# EAGLE design 4_digit_display (EAGLE 6.6.0)
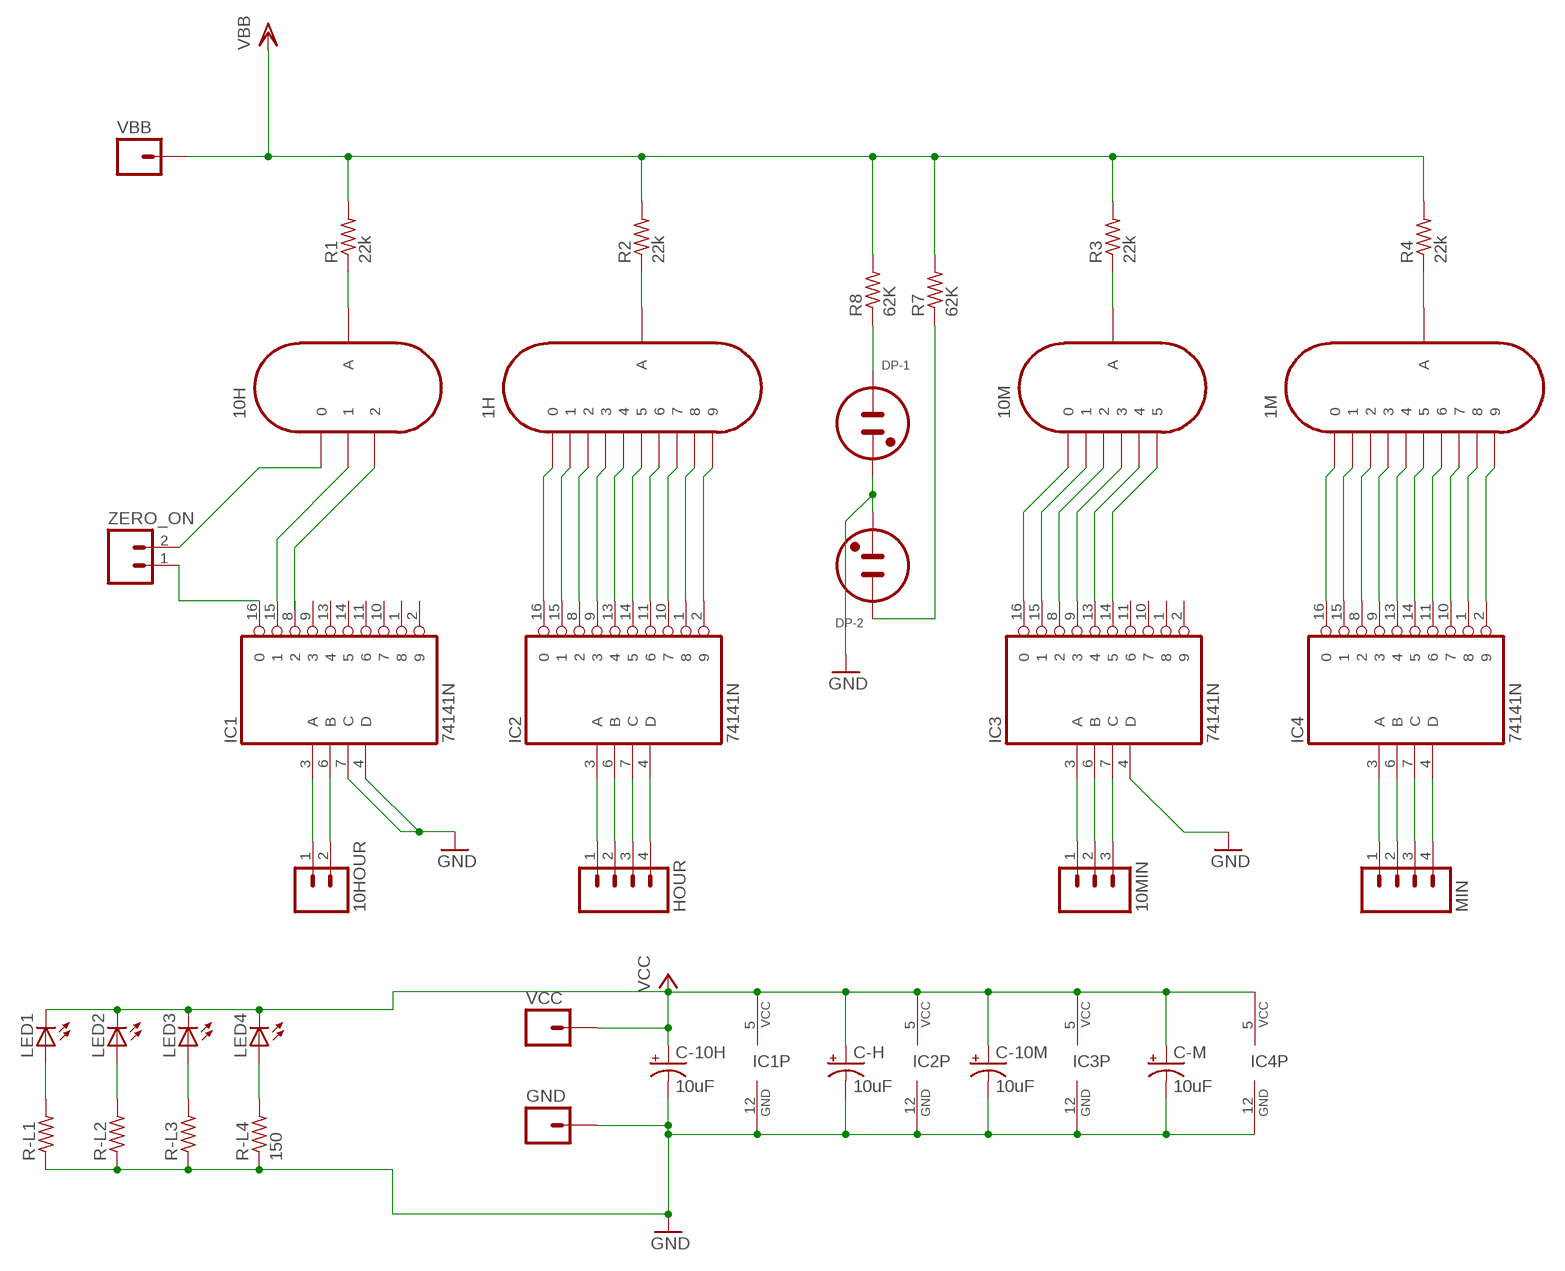
[diagram p0: schematic, sheet 1]

## Parts
1H  IN-12A-NO_DP  [IN-12_NO-DP]
1M  IN-12A-NO_DP  [IN-12_NO-DP]
10H  IN-12_2DIGIT  [IN-12_2DIGIT]
10HOUR  M02PTH  [1X02]
10M  IN-12_6DIGIT  [IN-12_6DIGIT]
10MIN  M03PTH  [1X03]
C-10H  10uF  CAPACITOR_POLB/3528-21R  [B/3528-21R]
C-10M  10uF  CAPACITOR_POLB/3528-21R  [B/3528-21R]
C-H  10uF  CAPACITOR_POLB/3528-21R  [B/3528-21R]
C-M  10uF  CAPACITOR_POLB/3528-21R  [B/3528-21R]
DP-1  INS-1  [INS-1]
DP-2  INS-1  [INS-1]
GND  M01PTH  [1X01]
HOUR  M04PTH  [1X04]
IC1  74141N  [DIL16]
IC2  74141N  [DIL16]
IC3  74141N  [DIL16]
IC4  74141N  [DIL16]
LED1  LED1210  [LED1210]
LED2  LED1210  [LED1210]
LED3  LED1210  [LED1210]
LED4  LED1210  [LED1210]
MIN  M04PTH  [1X04]
R1  22k  RESISTOR0207/10  [0207/10]
R2  22k  RESISTOR0207/10  [0207/10]
R3  22k  RESISTOR0207/10  [0207/10]
R4  22k  RESISTOR0207/10  [0207/10]
R7  62K  RESISTOR0207/10  [0207/10]
R8  62K  RESISTOR0207/10  [0207/10]
R-L1  RESISTORR1206  [R1206]
R-L2  RESISTORR1206  [R1206]
R-L3  RESISTORR1206  [R1206]
R-L4  150  RESISTORR1206  [R1206]
VBB  M01PTH  [1X01]
VCC  M01PTH  [1X01]
ZERO_ON  M02PTH  [1X02]

## Nets
GND: C-10H.- C-10M.- C-H.- C-M.- DP-1.K DP-2.K GND.1 IC1.4(D) IC1.7(C) IC1.12(GND) IC2.12(GND) IC3.4(D) IC3.12(GND) IC4.12(GND) R-L1.1 R-L2.1 R-L3.1 R-L4.1
N$1: 1M.0 IC4.16
N$2: 1M.1 IC4.15
N$3: 1M.2 IC4.8
N$4: 1M.3 IC4.9
N$5: 1M.4 IC4.13
N$6: 1M.5 IC4.14
N$7: 1M.6 IC4.11
N$8: 1M.7 IC4.10
N$9: 1M.8 IC4.1
N$10: 1M.9 IC4.2
N$11: 10M.0 IC3.16
N$12: 10M.1 IC3.15
N$13: 10M.2 IC3.8
N$14: 10M.3 IC3.9
N$15: 10M.4 IC3.13
N$16: 10M.5 IC3.14
N$17: 1H.0 IC2.16
N$18: 1H.1 IC2.15
N$19: 1H.2 IC2.8
N$20: 1H.3 IC2.9
N$21: 1H.4 IC2.13
N$22: 1H.5 IC2.14
N$23: 1H.6 IC2.11
N$24: 1H.7 IC2.10
N$25: 1H.8 IC2.1
N$26: 1H.9 IC2.2
N$27: 10H.1 IC1.15
N$28: 10H.2
N$29: DP-1.A R8.1
N$30: DP-2.A R7.1
N$31: IC4.3(A) MIN.1
N$32: 1M.A R4.1
N$33: 10M.A R3.1
N$34: 1H.A R2.1
N$35: 10H.A R1.1
N$36: IC4.6(B) MIN.2
N$37: IC4.7(C) MIN.3
N$38: IC4.4(D) MIN.4
N$39: 10MIN.1 IC3.3(A)
N$40: 10MIN.2 IC3.6(B)
N$41: 10MIN.3 IC3.7(C)
N$42: HOUR.1 IC2.3(A)
N$43: HOUR.2 IC2.6(B)
N$44: HOUR.3 IC2.7(C)
N$45: HOUR.4 IC2.4(D)
N$46: 10HOUR.1 IC1.3(A)
N$47: 10HOUR.2 IC1.6(B)
N$48: IC1.16 ZERO_ON.1
N$49: 10H.0 ZERO_ON.2
N$76: LED1.A R-L1.2
N$77: LED2.A R-L2.2
N$78: LED3.A R-L3.2
N$79: LED4.A R-L4.2
VBB: R1.2 R2.2 R3.2 R4.2 R7.2 R8.2 VBB.1
VCC: C-10H.+ C-10M.+ C-H.+ C-M.+ IC1.5(VCC) IC2.5(VCC) IC3.5(VCC) IC4.5(VCC) LED1.C LED2.C LED3.C LED4.C VCC.1
Unconnected: IC1.1 IC1.2 IC1.8 IC1.9 IC1.10 IC1.11 IC1.13 IC1.14 IC3.1 IC3.2 IC3.10 IC3.11

## Library data of the parts
1H 1M = iStivi - Tubes:IN-12A: IN-12A: medium numeric topview nixie tube
10H = iStivi - Tubes:IN-12_2DIGIT: IN-12 DIGITS 0-2 IN-12 nixie tube using only pins 0-2 for clock display.
10HOUR ZERO_ON = iStivi - Header-Connector:M02: Header 2 Standard 2-pin 0.1" header. Use with straight break away headers (SKU : PRT-00116), right angle break away headers (PRT-00553), swiss pins (PRT-00743), machine pins (PRT-00117), and female headers (PRT-00115). Molex polarized connector foot print use with SKU : PRT-08233 with associated crimp pins and housings.
10M = iStivi - Tubes:IN-12_6DIGIT: IN-12 DIGITS 0-6 IN-12 pin layout with only the pins 0-5 connected. For clock display.
10MIN = iStivi - Header-Connector:M03: Header 3 Standard 3-pin 0.1" header. Use with straight break away headers (SKU : PRT-00116), right angle break away headers (PRT-00553), swiss pins (PRT-00743), machine pins (PRT-00117), and female headers (PRT-00115). Molex polarized connector foot print use with SKU : PRT-08232 with associated crimp pins and housings.
C-10H C-10M C-H C-M = iStivi - RCLD:CAPACITOR_POL: POLARIZED CAPACITOR, American symbol
DP-1 DP-2 = iStivi - Tubes:INS-1: INS-1 Neon indicator (wire connection)
GND VBB VCC = iStivi - Header-Connector:M01: Header 1 Standard 1-pin 0.1" header. Use with straight break away headers (SKU : PRT-00116), right angle break away headers (PRT-00553), swiss pins (PRT-00743), machine pins (PRT-00117), and female headers (PRT-00115).
HOUR MIN = iStivi - Header-Connector:M04: Header 4 Standard 4-pin 0.1" header. Use with straight break away headers (SKU : PRT-00116), right angle break away headers (PRT-00553), swiss pins (PRT-00743), machine pins (PRT-00117), and female headers (PRT-00115). Molex polarized connector foot print use with SKU : PRT-08231 with associated crimp pins and housings. 1MM SMD Version SKU: PRT-10208
IC1-IC4 = iStivi - ICs:74*141: Nixie Driver BCD to decimal decoder/driver
LED1-LED4 = iStivi - LED:LED: LEDs Standard schematic elements and footprints for 5mm, 3mm, 1206, and 0603 sized LEDs. 5mm - Spark Fun Electronics SKU : COM-00529 (and others)
R1-R4 R7 R8 R-L1-R-L4 = iStivi - RCLD:RESISTOR: RESISTOR

## Board
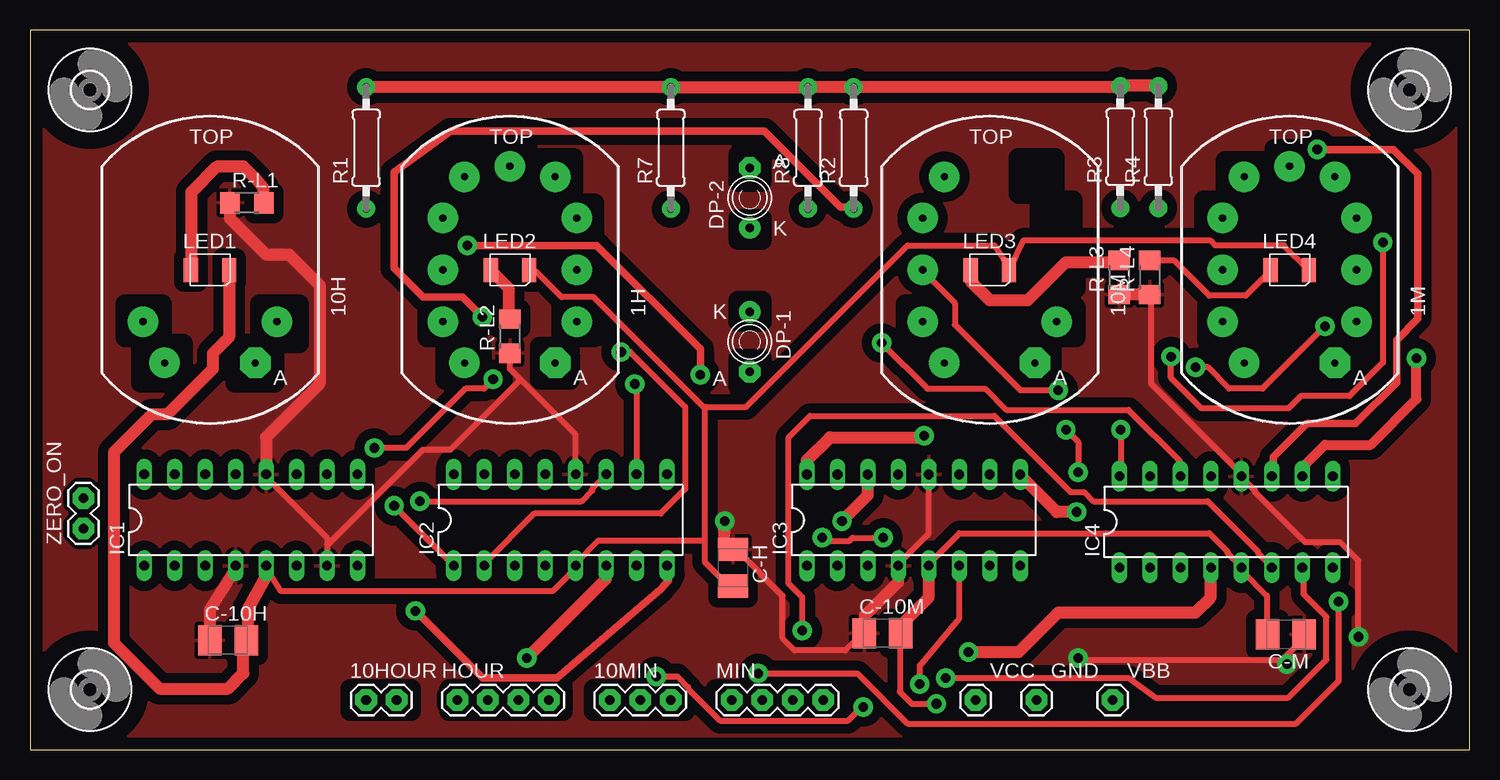
[diagram p1: board, top side]
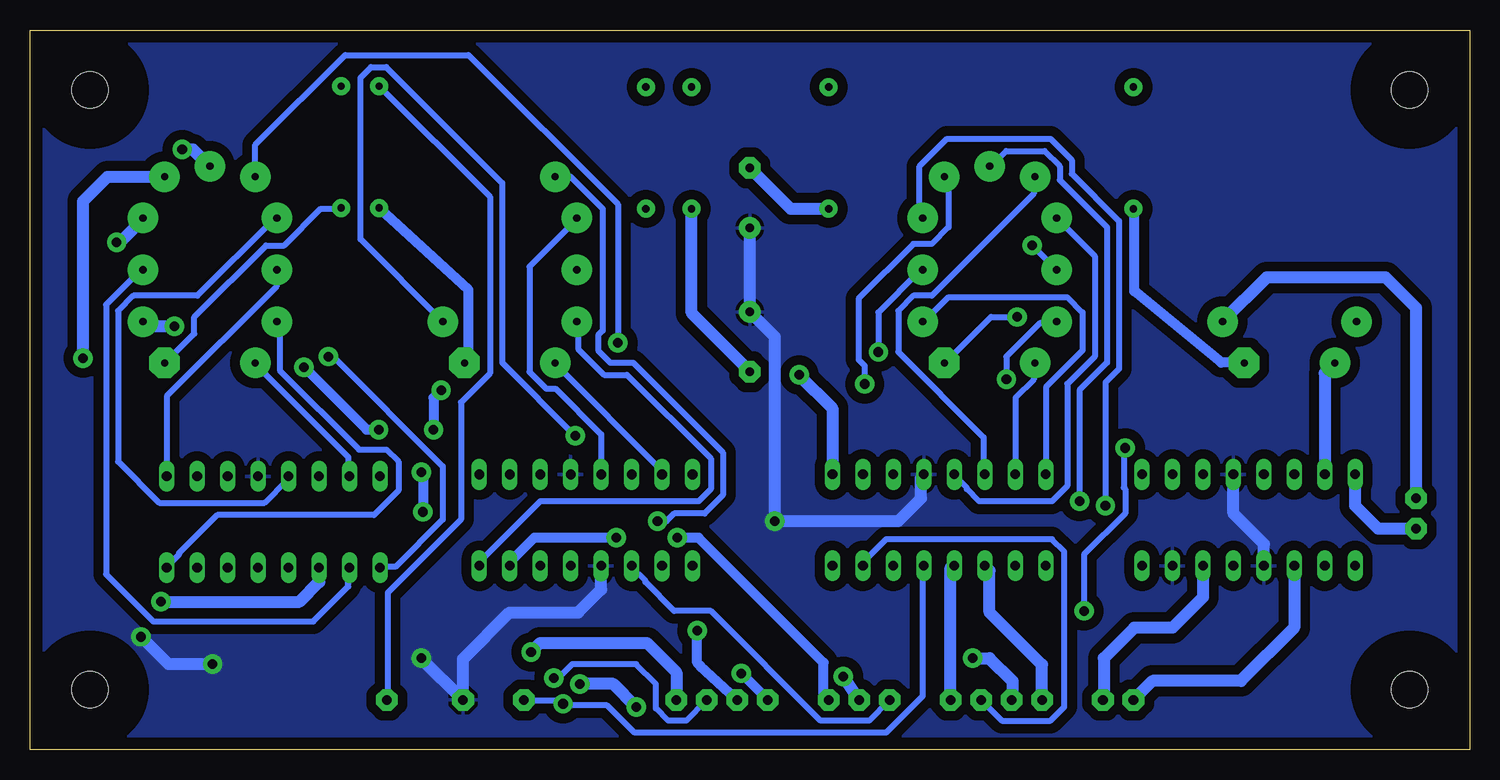
[diagram p2: board, bottom side, seen from below]

Size 120 x 60 mm. Coordinates in mm from the lower left corner, seen from the top.
Outline: 0,0 120,0 120,60 0,60 0,0
Copper layers (1*16): Top 0.035mm / dielectric 1.5mm / Bottom 0.035mm
Design rules "iStivi-0.8mm via-20mil-track": minimum track width 20mil, minimum drill 0.8mm, track to track 20mil, track to pad 20mil, pad to pad 10mil, via to via 20mil, smd to smd 10mil, copper to edge 40mil, drill to drill 8mil, minimum pad ring 10mil, minimum via ring 16mil, stop-mask expansion 0mil, vias tented up to drill 0mil, thermal gap 12mil
tRestrict: area 8,34.4 to 11,37.2; area 9.2,30.6 to 12.8,33.9; area 17.1,30.6 to 20.4,33.9; area 19.1,33.9 to 22.4,37.2; area 33.1,43 to 35.9,45.5; area 32.8,38.7 to 35.9,41.2; area 33.1,34.4 to 35.6,36.9; area 34.6,30.8 to 37.7,33.6; area 42.5,30.8 to 45,33.6; area 44.3,34.4 to 47.1,37.2; area 44,38.4 to 47.3,41.5; area 44,43 to 47.1,45.5; 32 more areas

### Footprints (pad centres in the part's own frame; a part is rotated, then mirrored left to right if it is on the bottom)
IN-12_NO-DP = drill 0.6 pad 2.54: 0 5.59,-4.32; 1 -3.78,-7.766; 2 -5.59,-4.32; 3 -5.59,0; 4 -5.59,4.32; 5 -3.78,7.766; 6 0,8.64; 7 3.78,7.766; 8 5.59,4.32; 9 5.59,0 | drill 0.6 pad 2.54 octagon: A 3.78,-7.766
IN-12_2DIGIT = drill 0.6 pad 2.54: 0 5.59,-4.32; 1 -3.78,-7.766; 2 -5.59,-4.32 | drill 0.6 pad 2.54 octagon: A 3.78,-7.766
1X02 = drill 0.8 pad 1.8 octagon: 1 0,0; 2 2.54,0
IN-12_6DIGIT = drill 0.6 pad 2.54: 0 5.59,-4.32; 1 -3.78,-7.766; 2 -5.59,-4.32; 3 -5.59,0; 4 -5.59,4.32; 5 -3.78,7.766 | drill 0.6 pad 2.54 octagon: A 3.78,-7.766
1X03 = drill 0.8 pad 1.8 octagon: 1 0,0; 2 2.54,0; 3 5.08,0
B/3528-21R = smd 1.95 x 2.5: + 1.525,0; - -1.525,0
INS-1 = drill 0.7 pad 1.8 octagon: A 0,2.5 | drill 0.7 pad 1.8: K 0,-2.5
1X01 = drill 0.8 pad 1.8 octagon: 1 0,0
1X04 = drill 0.8 pad 1.8 octagon: 1 0,0; 2 2.54,0; 3 5.08,0; 4 7.62,0
DIL16 = drill 0.8 long: 1 -8.89,-3.81; 2 -6.35,-3.81; 3 -3.81,-3.81; 4 -1.27,-3.81; 5 1.27,-3.81; 6 3.81,-3.81; 7 6.35,-3.81; 8 8.89,-3.81; 9 8.89,3.81; 10 6.35,3.81; 11 3.81,3.81; 12 1.27,3.81; 13 -1.27,3.81; 14 -3.81,3.81; 15 -6.35,3.81; 16 -8.89,3.81
LED1210 = smd 1.2 x 2: A -1.6,0; C 1.6,0
0207/10 = drill 0.6 pad 1.5: 1 -5.08,0; 2 5.08,0
R1206 = smd 1.6 x 1.803: 1 -1.422,0; 2 1.422,0
3,0 = hole 3: 0,0

### Placement (x,y rotation side)
1H  40,40 0 top
1M  105,40 0 top
10H  15,40 0 top
10HOUR  28.02,4.13 0 top
10M  80,40 0 top
10MIN  48.34,4.13 0 top
C-10H  16.51,9.12 0 top
C-10M  71.07,9.7 0 top
C-H  58.6,15.16 270 top
C-M  104.69,9.6 180 top
DP-1  60,34 180 top
DP-2  60,46 0 top
GND  83.9,4.13 0 top
HOUR  35.64,4.13 0 top
IC1  18.41,19.14 0 top
IC2  44.22,19.14 0 top
IC3  73.66,19.13 0 top
IC4  99.71,18.97 0 top
LED1  15,40 0 top
LED2  40,40 0 top
LED3  80,40 0 top
LED4  105,40 0 top
MIN  58.5,4.13 0 top
R1  28.02,50.17 90 top
R2  68.66,50.17 90 top
R3  90.89,50.24 90 top
R4  94.06,50.24 90 top
R7  53.42,50.17 90 top
R8  64.85,50.17 90 top
R-L1  18.08,45.59 0 top
R-L2  40,34.46 90 top
R-L3  90.81,39.37 90 top
R-L4  93.34,39.37 90 top
U$2  [3,0]  5,55 0 top
U$3  [3,0]  5,5 0 top
U$4  [3,0]  115,5 0 top
U$5  [3,0]  115,55 0 top
VBB  90.25,4.13 0 top
VCC  78.82,4.13 0 top
ZERO_ON  4.45,18.41 90 top

### Tracks (layer width: path | path; a pad name or v marks a point on that pad's centre or on a via)
GND  (via drill 0.8)
  Top 0.508: 40.89,30.86 45.47,26.29 45.47,22.99 IC2.12 | 40.89,30.86 40.01,31.75 40.01,33.02 R-L2.1 | IC1.4 17.14,15.11 | 14.99,9.14 C-10H.- | 24.77,17.14 24.77,17.65 19.68,22.73 IC1.12 | 24.77,17.14 IC1.7 | 40.89,30.86 35.05,25.02 32.77,25.02 24.89,17.14 24.77,17.14 | 72.39,15.11 IC3.4 72.39,15.49 74.93,18.03 IC3.12 | 69.6,9.78 C-10M.- 69.34,9.65 67.94,8.26 63.75,8.26 62.74,9.27 62.74,12.83 58.93,16.64 58.67,16.64 C-H.- 58.55,16.89 57.91,17.53 | 90.81,37.97 R-L3.1 | 93.34,37.97 R-L4.1 93.47,37.72 93.47,30.48 101.09,22.86 IC4.12 101.09,22.61 102.11,21.59 102.11,21.46 106.3,17.27 109.22,17.27 110.74,15.75 v110.74,9.4 | 104.39,7.49 106.17,9.27 106.17,9.53 C-M.- | 104.39,7.49 87.5,7.49 v87.38,7.62 | 104.39,7.49 v104.78,7.11
  Top 1.016: 14.99,9.14 14.99,11.68 17.14,15.11 | 57.91,17.53 v57.91,19.05 | R-L1.1 16.66,44.3 19.68,41.27 21.59,41.27 24.13,38.73 24.13,30.48 19.68,26.04 IC1.12 | 90.81,37.97 93.22,37.97 93.34,38.1 R-L4.1 | 69.6,9.78 69.6,11.18 72.39,13.97 IC3.4
  Bottom 1.016: IC1.4 17.14,17.14 19.68,19.68 IC1.12 | IC2.12 45.72,22.71 45.72,20.95 47.62,19.05 v57.91,19.05 57.91,34.41 DP-1.K DP-2.K | v104.78,7.11 108.46,7.11 v110.74,9.4 | v87.38,7.62 87.38,7.61 GND.1 83.9,7.54 80.01,11.43 74.3,11.43 72.39,13.34 IC3.4
  pour Bottom (isolate 0.813): 0,0 120,0 120,60 0,60
  pour Top (isolate 0.813): 0,0 120,0 120,60 0,60
N$1  (via drill 0.8)
  Top 0.508: v90.93,26.67 90.93,22.86 IC4.16 | v97.16,31.88 98.17,31.88 99.95,30.1 102.74,30.1 v107.95,35.31
  Bottom 0.508: 110.49,35.56 110.24,35.31
  Bottom 0.813: v90.93,26.67 91.95,26.67 v97.16,31.88
  Bottom 1.016: 110.24,35.31 v107.95,35.31 | 110.49,35.56 1M.0
N$2
  Bottom 0.508: IC4.15 93.47,22.86 93.47,24.38 101.22,32.13 1M.1
N$3
  Bottom 0.508: IC4.8 108.58,15.24 107.57,16.26 107.57,16.38 104.39,19.56 91.31,19.56 89.28,21.59 89.28,24 90.3,25.02 92.58,25.02 99.19,31.62 99.19,35.43 99.31,35.56 1M.2
N$4
  Bottom 0.508: IC4.9 108.58,22.86 108.58,29.46 99.44,38.61 99.44,39.88 1M.3
N$5
  Bottom 0.508: IC4.13 98.55,22.73 98.55,22.48 100.46,20.57 109.22,20.57 112.65,24 112.65,36.58 111.38,37.85 106.05,37.85 99.69,44.2 99.44,44.2 1M.4
N$6  (via drill 0.8)
  Top 0.508: v70.99,33.91 74.8,30.1 79.63,30.1 81.41,28.32 91.57,28.32 95.89,24 95.89,22.86 IC4.14
  Bottom 0.508: v70.99,33.91 70.99,45.47 83.44,57.91 93.73,57.91 101.22,50.42 101.22,47.88 1M.5
N$7  (via drill 0.8)
  Top 0.508: 103.63,22.86 IC4.11
  Top 0.61: 103.63,22.86 103.63,24.38 106.43,27.18 110.49,27.18 113.92,30.61 113.92,34.16 115.7,35.94 115.7,48.01 113.67,50.04 v107.31,50.04
  Bottom 1.016: v107.31,50.04 106.43,50.04 105.03,48.64 1M.6
N$8  (via drill 0.8)
  Top 0.813: IC4.10 106.06,23.51 107.95,25.4 111.76,25.4 115.57,29.21 v115.57,32.64
  Bottom 1.016: v115.57,32.64 115.57,45.72 113.52,47.77 1M.7
N$9  (via drill 0.8)
  Top 0.508: v95.12,32.77 95.12,30.99 97.66,28.45 104.9,28.45 105.92,29.46 109.98,29.46 112.78,32.26 v112.78,42.29
  Bottom 0.508: v95.12,32.77 94.74,32.77 85.6,23.62 85.6,19.18 89.53,15.24 90.81,15.24 IC4.1
  Bottom 1.016: v112.78,42.29 112.52,42.29 110.62,44.2 1M.8
N$10
  Bottom 0.508: IC4.2 93.47,13.84 93.47,13.59 96.39,10.67 109.73,10.67 113.67,14.61 113.67,37.08 110.87,39.88 110.62,39.88 1M.9
N$11  (via drill 0.8)
  Top 1.016: IC3.16 64.77,24.13 66.67,26.04 74.42,26.04 v74.55,26.16
  Bottom 0.508: v74.55,26.16 80.64,32.26 80.64,47.24 90.3,56.9 91.57,56.9 92.46,56.01 92.46,42.55 10M.0
N$12
  Bottom 0.508: IC3.15 67.31,23.24 76.2,32.13 10M.1
N$13
  Bottom 0.508: IC3.8 82.55,15.62 77.47,20.7 64.26,20.7 63.25,21.72 63.25,24.26 70.23,31.24 72.14,31.24 74.3,33.4 74.3,35.56 10M.2
N$14  (via drill 0.8)
  Top 0.508: v87.38,23.11 87.38,25.65 v86.36,26.67 | v85.72,29.97 82.55,29.97 77.09,35.43 77.09,37.21 74.42,39.88 10M.3
  Top 1.016: v87.25,19.81 85.6,19.81 82.55,22.86 IC3.9
  Bottom 0.508: v87.38,23.11 87.25,22.99
  Bottom 0.813: 87.25,22.99 v87.25,19.81 | v86.36,26.67 86.36,29.34 v85.72,29.97
N$15
  Bottom 0.508: IC3.13 72.39,26.29 76.2,30.1 76.96,30.1 78.36,31.5 78.36,40.26 74.42,44.2 10M.4
N$16  (via drill 0.8)
  Top 1.016: IC3.14 69.85,21.21 v67.69,19.05
  Bottom 0.508: v67.69,19.05 66.93,19.05 66.29,19.68 63.75,19.68 62.23,21.21 62.23,24.77 69.72,32.26 71.63,32.26 72.64,33.27 72.64,34.54 72.26,34.92 72.26,45.09 74.93,47.75 76.2,47.75 10M.5
N$17
  Bottom 0.508: IC2.16 35.31,22.99 35.31,30.23 32.26,33.27 32.26,36.45 33.53,37.72 43.43,37.72 45.47,35.69 1H.0
N$18
  Bottom 0.508: IC2.15 37.85,22.99 37.85,29.34 36.32,30.86 36.32,32.13 1H.1
N$19  (via drill 0.8)
  Top 0.508: v28.7,25.15 31.37,25.15 36.32,30.1 37.85,30.1 v38.61,30.86 | 53.09,15.24 IC2.8
  Top 0.61: 53.09,15.24 53.21,14.1 52.58,13.34 43.94,5.97 37.72,5.97 v32.13,11.56
  Bottom 0.508: v32.13,11.56 32.13,16.26 28.7,19.68 28.7,21.72 28.83,21.84 28.83,25.02 v28.7,25.15 | v38.61,30.86 38.61,32.77 35.81,35.56 34.42,35.56 1H.2
N$20  (via drill 0.8)
  Top 0.61: v55.88,31.24 55.88,33.4 47.24,42.04 v36.45,42.04
  Bottom 0.508: v36.45,42.04 1H.3
  Bottom 1.016: v55.88,31.24 53.1,28.47 IC2.9
N$21
  Bottom 0.508: IC2.13 42.93,22.86 41.91,21.84 41.91,21.72 40.89,20.7 34.8,20.7 33.53,21.97 33.53,30.48 31.24,32.77 31.24,41.15 34.29,44.2 1H.4
N$22
  Bottom 0.508: IC2.14 40.51,22.99 40.51,26.04 47.62,33.15 47.62,36.58 46.35,37.85 44.83,37.85 36.32,46.35 36.32,47.75 1H.5
N$23  (via drill 0.8)
  Top 0.508: v32.51,20.7 45.97,20.7 46.86,21.59 46.86,21.72 48.01,22.86 IC2.11
  Bottom 0.508: v32.51,20.7 32.51,29.97 30.23,32.26 30.23,43.56 34.16,47.5 34.16,48.64 35.43,49.91 38.61,49.91 39.88,48.64 1H.6
N$24  (via drill 0.8)
  Top 0.508: v50.42,30.48 50.55,30.35 50.55,22.99 IC2.10
  Bottom 0.508: v50.42,30.48 50.42,32 50.93,32.51 50.93,37.59 46.35,42.16 44.83,42.16 43.43,43.56 43.43,47.5 43.69,47.75 1H.7
N$25  (via drill 0.8)
  Top 0.508: v30.35,20.32 35.31,15.37 IC2.1
  Bottom 0.508: v30.35,20.32 30.35,30.61 29.21,31.75 29.21,44.07 33.15,48.01 33.15,49.15 34.92,50.93 43.56,50.93 45.85,48.64 45.85,44.58 1H.8
N$26  (via drill 0.8)
  Top 0.508: v49.28,33.15 50.04,33.15 54.61,28.57 54.61,21.72 52.58,19.68 42.04,19.68 37.97,15.62 37.97,15.37 IC2.2
  Bottom 0.508: v49.28,33.15 49.28,36.45 45.85,39.88 45.59,39.88 1H.9
N$27
  Bottom 0.508: 11.3,32.13 10H.1
  Bottom 1.016: IC1.15 12.06,31.37 11.3,32.13
N$29
  Bottom 1.016: R8.1 64.85,36.4 60.07,31.62 60.07,31.57 DP-1.A
N$30
  Bottom 1.016: DP-2.A 56.59,45.09 R7.1
N$31  (via drill 0.8)
  Top 0.508: v109.09,12.32 109.09,5.71 105.54,2.16 73.15,2.16 68.96,6.35 v60.71,6.35
  Bottom 0.813: MIN.1 v60.71,6.35
  Bottom 1.016: v109.09,12.32 97.54,12.32 95.89,13.97 95.89,15.14 IC4.3
N$32
  Bottom 0.508: R4.1 94.11,45.09 95.76,45.09 98.81,42.04 100.33,42.04 106.3,36.07 106.3,34.67 108.71,32.26 1M.A
N$33
  Bottom 0.508: 83.69,32.26 83.44,32.51 | 90.81,45.09 R3.1
  Bottom 0.813: 90.81,45.09 83.44,38.35 83.44,32.51 | 83.69,32.26 10M.A
N$34  (via drill 0.8)
  Top 0.508: 68.58,45.21 R2.1
  Top 0.61: 68.58,45.21 67.56,45.21 61.21,51.56 35.05,51.56 30.35,48.13 30.35,40.13 32.77,37.72 36.07,37.72 v37.72,36.07
  Bottom 0.508: v37.72,36.07 39.88,36.07 43.69,32.26 1H.A
N$35
  Bottom 0.508: 27.94,45.09 R1.1 | 18.8,32.26 10H.A
  Bottom 0.813: 27.94,45.09 27.94,38.23 20.7,32.26 18.8,32.26
N$36  (via drill 0.8)
  Top 0.508: v64.39,9.91 64.39,12.7 63.25,13.84 63.25,26.04 65.02,27.81 80.39,27.81 86.74,21.46 87.88,21.46 88.65,20.7 98.17,20.7 102.36,16.51 102.36,16.38 103.5,15.24 IC4.6
  Bottom 0.813: 61.15,4.24 64.14,6.99 64.39,7.24 v64.39,9.91 | MIN.2 61.15,4.24
  Bottom 1.016: 61.09,4.19 61.15,4.24
N$37  (via drill 0.8)
  Top 0.508: v76.33,5.97 91.57,5.97 93.85,4.32 104.9,4.32 108.08,7.49 108.08,11.05 106.17,12.95 106.17,15.11 IC4.7
  Bottom 0.508: v76.33,5.97 75.95,5.97 74.8,7.11 69.47,7.11 67.82,5.46 67.82,3.43 66.8,2.41 65.28,2.41 63.63,4.06 MIN.3
N$38  (via drill 0.8)
  Top 1.016: v78.23,8.13 82.42,8.13 85.72,11.43 97.16,11.43 98.42,12.7 98.42,15.14 IC4.4
  Bottom 1.016: v78.23,8.13 77.47,8.89 68.58,8.89 66.12,6.43 MIN.4
N$39
  Bottom 0.508: IC3.3 69.85,15.24 68.71,14.1 68.71,13.97 66.29,11.56 63.25,11.56 54.1,2.41 50.04,2.41 48.39,4.06 10MIN.1
N$40  (via drill 0.8)
  Top 0.508: IC3.6 77.47,10.92 74.17,6.99 v74.17,5.46 | v69.47,3.56 69.34,3.56 68.2,2.41 57.53,2.41 54.86,5.08 54.86,5.21 53.98,6.1 v52.2,6.1
  Bottom 1.016: v69.47,3.56 71.37,5.46 v74.17,5.46 | v52.2,6.1 50.93,4.19 10MIN.2
N$41  (via drill 0.8)
  Top 0.508: v71.12,17.65 68.58,17.65 68.33,17.4 66.29,17.4 v66.04,17.65
  Bottom 0.508: 53.47,4.19 53.85,4.57
  Bottom 0.813: IC3.7 80.01,15.62 77.98,17.65 v71.12,17.65 | v66.04,17.65 64.26,17.65 53.85,7.24 53.85,4.57 | 53.47,4.19 10MIN.3
N$42
  Bottom 1.016: HOUR.1 35.64,7.07 40.01,11.43 40.01,14.93 IC2.3
N$43  (via drill 0.8)
  Top 0.508: 48.01,15.24 IC2.6
  Top 1.016: 48.01,15.24 48.01,14.22 v41.4,7.62
  Bottom 1.016: v41.4,7.62 40.01,7.62 38.1,5.71 38.1,4.21 HOUR.2
N$44
  Bottom 0.508: IC2.7 50.55,15.37 50.55,15.62 48.64,17.53 34.8,17.53 33.78,16.51 33.78,3.56 34.92,2.41 38.99,2.41 40.64,4.06 HOUR.3
N$45
  Bottom 1.016: HOUR.4 43.26,15.16 43.18,15.24 43.03,15.24 IC2.4
N$46
  Bottom 1.016: IC1.3 14.61,10.16 19.05,5.71 26.43,5.71 10HOUR.1
N$47
  Bottom 1.016: IC1.6 22.23,12.7 24.77,10.16 27.94,10.16 30.48,7.62 30.48,4.21 10HOUR.2
N$48
  Bottom 1.016: ZERO_ON.1 7.62,18.41 9.53,20.32 IC1.16
N$49
  Bottom 1.016: ZERO_ON.2 4.45,36.83 6.99,39.37 16.9,39.37 10H.0
N$76
  Top 0.508: 19.43,45.59 R-L1.2 | 13.46,40.01 LED1.A
  Top 1.016: 19.43,45.59 19.43,46.86 18.8,47.62 17.78,48.64 15.62,48.64 13.46,46.48 13.46,40.01
N$77
  Top 0.508: 39.88,35.94 R-L2.2 | 38.48,39.88 LED2.A
  Top 1.016: 39.88,35.94 39.88,38.48 38.48,39.88
N$78
  Top 1.016: LED3.A 78.4,39.08 80.01,37.47 83.19,37.47 86.36,40.64 90.65,40.64 R-L3.2
N$79
  Top 0.508: R-L4.2 93.34,40.77 95.38,40.77 98.3,37.85 101.35,37.85 103.38,39.88 LED4.A
VBB
  Top 0.508: 64.9,55.24 R8.2 64.64,55.24 | 68.58,55.24 R2.2 68.83,55.24 | 28.07,55.24 R1.2 | 53.34,55.24 R7.2 53.59,55.24 | 90.93,55.37 R3.2 90.68,55.24 | 93.98,55.37 R4.2
  Top 1.016: 68.58,55.24 64.9,55.24 | 53.34,55.24 28.07,55.24 | 53.59,55.24 64.64,55.24 | 93.98,55.37 90.93,55.37 | 90.68,55.24 68.83,55.24
  Bottom 0.508: R3.2 81.66,46.1 81.66,31.37 84.07,28.96 84.07,19.18 90.17,13.08 90.17,4.19 VBB.1
VCC  (via drill 0.8)
  Top 0.508: C-M.+ 103.12,9.65 103.12,12.83 101.09,14.86 101.09,15.11 IC4.5 100.84,15.37 99.82,16.38 99.82,16.51 98.3,18.03 77.47,18.03 74.93,15.49 IC3.5 | v75.56,3.81 73.53,3.81 72.52,4.83 72.52,9.53 C-10M.+ | 18.16,9.14 C-10H.+ | 19.68,14.48 IC1.5 19.81,14.99 20.95,13.21 43.56,13.21 45.47,15.11 IC2.5 45.59,15.37 45.59,15.62 47.37,17.4 56.26,17.4 | LED4.C 106.55,40.01 104.52,42.04 98.81,42.04 98.42,42.42 82.8,42.42 81.66,40.01 LED3.C 81.41,40.13 81.66,40.13 80.39,42.04 73.15,42.04 59.69,28.57 56.39,28.57 56.26,28.45 | 56.26,28.45 46.99,37.72 44.32,37.72 42.16,39.88 41.66,39.88 LED2.C | 56.26,17.4 56.26,15.62 58.17,13.72 58.55,13.72 C-H.+ | 56.26,17.4 56.26,28.45
  Top 0.61: C-10M.+ 72.6,10.37
  Top 1.016: 18.16,9.14 18.16,11.68 19.68,14.48 | LED1.C 16.6,34.38 15.24,33.02 15.24,31.75 11.43,27.94 10.16,27.94 6.99,24.77 6.99,8.89 10.79,5.08 16.51,5.08 17.78,6.35 17.78,8.87 C-10H.+ | 72.6,10.37 74.93,12.7 IC3.5
  Bottom 0.508: IC2.5 45.59,15.24 45.59,4.45 48.64,1.4 69.6,1.4 71.88,3.68 75.44,3.68 v75.56,3.81 75.82,4.06 78.74,4.06 78.87,4.19 VCC.1

### Text on the board
_tplace: 4 DIGIT / NIXIE CLOCK | TOP | TOP | TOP | TOP | A | K | K | A | A | A | A | A | ZERO ON | 10H | 1H | 10M | 1M | GND | +180V | A | B | A | B | C | D | A | B | C | A | B | C | D | +5V